# EAGLE design LaserConverterBoard (EAGLE 7.1.0)
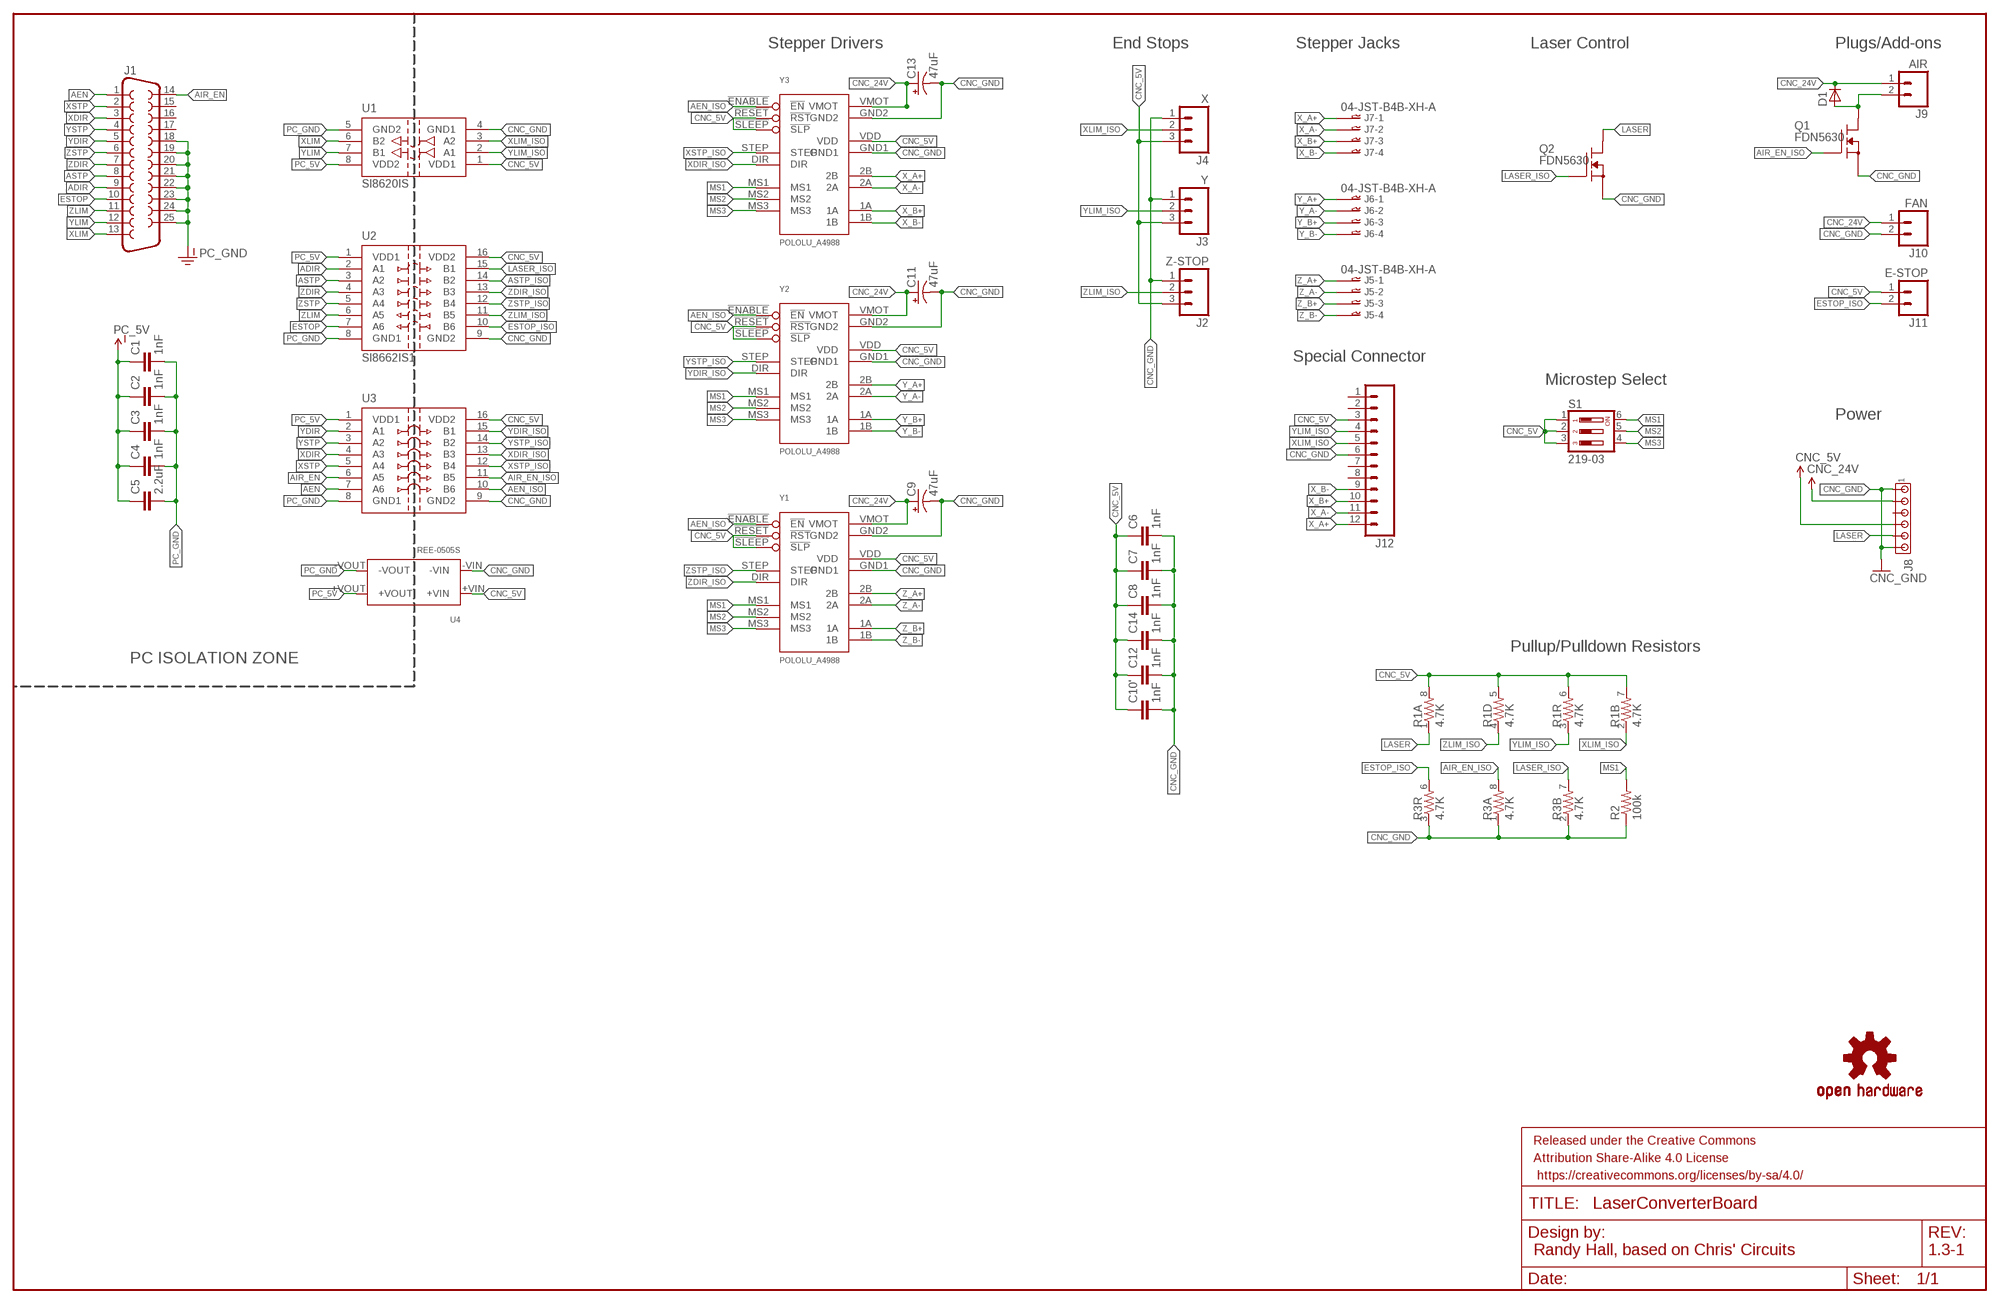
[diagram p0: schematic, sheet 1]

## Parts
C1  1nF  1NF/1000PF-50V-10%(0603)  [0603-CAP]
C2  1nF  1NF/1000PF-50V-10%(0603)  [0603-CAP]
C3  1nF  1NF/1000PF-50V-10%(0603)  [0603-CAP]
C4  1nF  1NF/1000PF-50V-10%(0603)  [0603-CAP]
C5  2.2uF  1NF/1000PF-50V-10%(0603)  [0603-CAP]
C6  1nF  1NF/1000PF-50V-10%(0603)  [0603-CAP]
C7  1nF  1NF/1000PF-50V-10%(0603)  [0603-CAP]
C8  1nF  1NF/1000PF-50V-10%(0603)  [0603-CAP]
C9  47uF  CPOL-USE  [PANASONIC_E]
C10'  1nF  1NF/1000PF-50V-10%(0603)  [0603-CAP]
C11  47uF  CPOL-USE  [PANASONIC_E]
C12  1nF  1NF/1000PF-50V-10%(0603)  [0603-CAP]
C13  47uF  CPOL-USE  [PANASONIC_E]
C14  1nF  1NF/1000PF-50V-10%(0603)  [0603-CAP]
D1  D-SOD123  [SOD123]
FRAME1  FRAME-LEDGER  [CREATIVE_COMMONS]
J1  F25HP  [F25HP]
J2  Z-STOP  M03PTH  [1X03]
J3  Y  M03PTH  [1X03]
J4  X  M03PTH  [1X03]
J5  04-JST-B4B-XH-A  [B4B-XH]
J6  04-JST-B4B-XH-A  [B4B-XH]
J7  04-JST-B4B-XH-A  [B4B-XH]
J8  MTA06-156  [1X6MTA]
J9  AIR  M02PTH  [1X02]
J10  FAN  M02PTH  [1X02]
J11  E-STOP  M02PTH  [1X02]
J12  M12  [12P]
LOGO1  OSHW-LOGOS  [OSHW-LOGO-S]
Q1  FDN5630  [SOT23]
Q2  FDN5630  [SOT23]
R1  4.7K  RESISTOR-ARRAY0603-ARV  [0603-ARV]
R2  100k  100KOHM1/10W1%(0603)  [0603-RES]
R3  4.7K  RESISTOR-ARRAY0603-ARV  [0603-ARV]
S1  219-03  [CTS-219-03]
U1  SI8620IS  [SO08]
U2  SI8662IS1  SI8462IS1  [SO16]
U3  SI8460IS1  [SO16]
U4  REE-0505S  [SIP7]
Y1  POLOLU_A4988  [POLOLU_STEPPER_DRIVER]
Y2  POLOLU_A4988  [POLOLU_STEPPER_DRIVER]
Y3  POLOLU_A4988  [POLOLU_STEPPER_DRIVER]

## Nets
ADIR: J1.9 U2.2(A1)
AEN: J1.1 U3.7(A6)
AEN_ISO: U3.10(B6) Y1.!ENABLE(!EN) Y2.!ENABLE(!EN) Y3.!ENABLE(!EN)
AIR_EN: J1.14 U3.6(A5)
AIR_EN_ISO: Q1.1(G) R3.8 U3.11(B5)
ASTP: J1.8 U2.3(A2)
ASTP_ISO: U2.14(B2)
CNC_5V: C6.1 C7.1 C8.1 C10'.1 C12.1 C14.1 J2.3 J3.3 J4.3 J8.4 J11.1 J12.3 R1.5 R1.6 R1.7 R1.8 S1.1 S1.2 S1.3 U1.1(VDD1) U2.16(VDD2) U3.16(VDD2) U4.+VIN Y1.!RESET(!RST) Y1.!SLEEP(!SLP) Y1.VDD Y2.!RESET(!RST) Y2.!SLEEP(!SLP) Y2.VDD Y3.!RESET(!RST) Y3.!SLEEP(!SLP) Y3.VDD
CNC_24V: C9.+ C11.+ C13.+ D1.1(C) J8.2 J9.1 J10.1 Y1.VMOT Y2.VMOT Y3.VMOT
CNC_GND: C6.2 C7.2 C8.2 C9.- C10'.2 C11.- C12.2 C13.- C14.2 J2.1 J3.1 J4.1 J8.1 J8.6 J10.2 J12.6 Q1.2(S) Q2.2(S) R2.1 R3.1 R3.2 R3.3 U1.4(GND1) U2.9(GND2) U3.9(GND2) U4.-VIN Y1.GND1 Y1.GND2 Y2.GND1 Y2.GND2 Y3.GND1 Y3.GND2
ESTOP: J1.10 U2.7(A6)
ESTOP_ISO: J11.2 R3.6 U2.10(B6)
LASER: J8.5 Q2.3(D) R1.1
LASER_ISO: Q2.1(G) R3.7 U2.15(B1)
MS1: R2.2 S1.6 Y1.MS1 Y2.MS1 Y3.MS1
MS2: S1.5 Y1.MS2 Y2.MS2 Y3.MS2
MS3: S1.4 Y1.MS3 Y2.MS3 Y3.MS3
N$8: D1.2(A) J9.2 Q1.3(D)
PC_5V: C1.1 C2.1 C3.1 C4.1 C5.1 U1.8(VDD2) U2.1(VDD1) U3.1(VDD1) U4.+VOUT
PC_GND: C1.2 C2.2 C3.2 C4.2 C5.2 J1.18 J1.19 J1.20 J1.21 J1.22 J1.23 J1.24 J1.25 U1.5(GND2) U2.8(GND1) U3.8(GND1) U4.-VOUT
X_A+: J7.P$1 J12.12 Y3.2B
X_A-: J7.P$2 J12.11 Y3.2A
X_B+: J7.P$3 J12.10 Y3.1A
X_B-: J7.P$4 J12.9 Y3.1B
XDIR: J1.3 U3.4(A3)
XDIR_ISO: U3.13(B3) Y3.DIR
XLIM: J1.13 U1.6(B2)
XLIM_ISO: J4.2 J12.5 R1.2 U1.3(A2)
XSTP: J1.2 U3.5(A4)
XSTP_ISO: U3.12(B4) Y3.STEP
Y_A+: J6.P$1 Y2.2B
Y_A-: J6.P$2 Y2.2A
Y_B+: J6.P$3 Y2.1A
Y_B-: J6.P$4 Y2.1B
YDIR: J1.5 U3.2(A1)
YDIR_ISO: U3.15(B1) Y2.DIR
YLIM: J1.12 U1.7(B1)
YLIM_ISO: J3.2 J12.4 R1.3 U1.2(A1)
YSTP: J1.4 U3.3(A2)
YSTP_ISO: U3.14(B2) Y2.STEP
Z_A+: J5.P$1 Y1.2B
Z_A-: J5.P$2 Y1.2A
Z_B+: J5.P$3 Y1.1A
Z_B-: J5.P$4 Y1.1B
ZDIR: J1.7 U2.4(A3)
ZDIR_ISO: U2.13(B3) Y1.DIR
ZLIM: J1.11 U2.6(A5)
ZLIM_ISO: J2.2 R1.4 U2.11(B5)
ZSTP: J1.6 U2.5(A4)
ZSTP_ISO: U2.12(B4) Y1.STEP
Unconnected: J1.15 J1.16 J1.17 J8.3 J12.1 J12.2 J12.7 J12.8 R3.4 R3.5

## Notes on the sheet
- Stepper Drivers | End Stops | Stepper Jacks | Laser Control | Plugs/Add-ons
- Special Connector
- Microstep Select
- Power
- Pullup/Pulldown Resistors
- PC ISOLATION ZONE
- Randy Hall, based on Chris' Circuits | 1.3-1

## Library data of the parts
C1-C4 C6-C8 C10' C12 C14 = SparkFun-Capacitors:1NF/1000PF-50V-10%(0603): CAP-07886; PROD_ID: CAP-07886
C5 = SparkFun-Capacitors:1NF/1000PF-50V-10%(0603): CAP-07886; PROD_ID: CAP-07886; VALUE: 1nF
C9 C11 C13 = rcl:CPOL-US: POLARIZED CAPACITOR, American symbol
D1 = semicon-smd-ipc:D-: DIODE unfilled
FRAME1 = SparkFun-Aesthetics:FRAME-LEDGER: Schematic Frame Standard 11x14 US Ledger frame
J1 = SparkFun-Connectors:F25: 25 Pin male connector. PCB edge mount for regular PCB thicknesses. This connector will connect directly to the back of a PC parallel port or through a normal DB25 extension cable (M/F). SKU: PRT-08287
J2-J4 = SparkFun-Connectors:M03: Header 3 Standard 3-pin 0.1" header. Use with straight break away headers (SKU : PRT-00116), right angle break away headers (PRT-00553), swiss pins (PRT-00743), machine pins (PRT-00117), and female headers (PRT-00115). Molex polarized connector foot print use with SKU : PRT-08232 with associated crimp pins and housings.
J5-J7 = con-jst-xh:04-JST: JST CONNECTOR
J8 = con-amp:MTA06-156: AMP connector
J9-J11 = SparkFun-Connectors:M02: Standard 2-pin 0.1" header. Use with - straight break away headers ( PRT-00116) - right angle break away headers (PRT-00553) - swiss pins (PRT-00743) - machine pins (PRT-00117) - female headers (PRT-00115) Molex polarized connector foot print use with: PRT-08233 with associated crimp pins and housings. 2.54_SCREWTERM for use with PRT-10571. 3.5mm Screw Terminal footprints for PRT-08084 5mm Screw Terminal footprints for use with PRT-08433
J12 = con-amp-te:M12: TE CONNECTIVITY FFC/FPC CONNECTOR 12P Used for FFC/FPC connections.; OC_FARNELL: unknown; OC_NEWARK: unknown
LOGO1 = SparkFun-Aesthetics:OSHW-LOGO: Open Source Hardware Logo This logo indicates the piece of hardware it is found on incorporates a OSHW license and/or adheres to the definition of open source hardware found here: http://freedomdefined.org/OSHW
Q1 Q2 = Fairchild_By_element14_Batch_1:FDN5630
R1 R3 = SparkFun-Resistors:RESISTOR-ARRAY: Array Chip Resistor Source: RS Component / Phycomp
R2 = SparkFun-Resistors:100KOHM1/10W1%(0603): RES-07828; PROD_ID: RES-07828
S1 = switch-dil:219-03*: Surface Mount DIP Switch Series 219 SMT CTS Electronic Components Sourc: www.ctscorp.com; OC_FARNELL: unknown; OC_NEWARK: unknown
U1 = silicon-labs:SI8620: Si8420 2 Channel (2/0) Digital Isolator Silicon Labs Si84xx ISOpro digital isolator series. The Si84xx ISOpro digital isolators provide low power galvanic isolation for digital signals. The '20 part has both signals in the same direction, with no output enables. It is available in SOIC-8 and wide SOIC-16 packages. They come in speeds of 1Mbps and 150Mbps, and isolation ratings of 1KV, 2.5KV and 5KV. The independent sides use 2.7-5.5V supplies and draw under 5mA per channel. http://www.silabs.com/Support%20Documents/TechnicalDocs/Si822x.pdf Donald Becker
U2 = silicon-labs:SI8462: Si8462 6 Channel (4/2) Digital Isolator Silicon Labs Si84xx ISOpro digital isolator series. The Si84xx ISOpro digital isolators provide low power galvanic isolation for digital signals. They come in speeds of 1Mbps and 150Mbps, and isolation ratings of 1KV, 2.5KV and 5KV. The independent sides use 2.7-5.5V supplies and draw under 5mA per channel. Donald Becker
U3 = silicon-labs:SI8460: Si8460 6 Channel (6/0) Digital Isolator Silicon Labs Si84xx ISOpro digital isolator series. The Si84xx ISOpro digital isolators provide low power galvanic isolation for digital signals. They come in speeds of 1Mbps and 150Mbps, and isolation ratings of 1KV, 2.5KV and 5KV. The independent sides use 2.7-5.5V supplies and draw under 5mA per channel. Donald Becker
U4 = recom-international:REE-0505S
Y1-Y3 = pololu:POLOLU_A4988

## Board
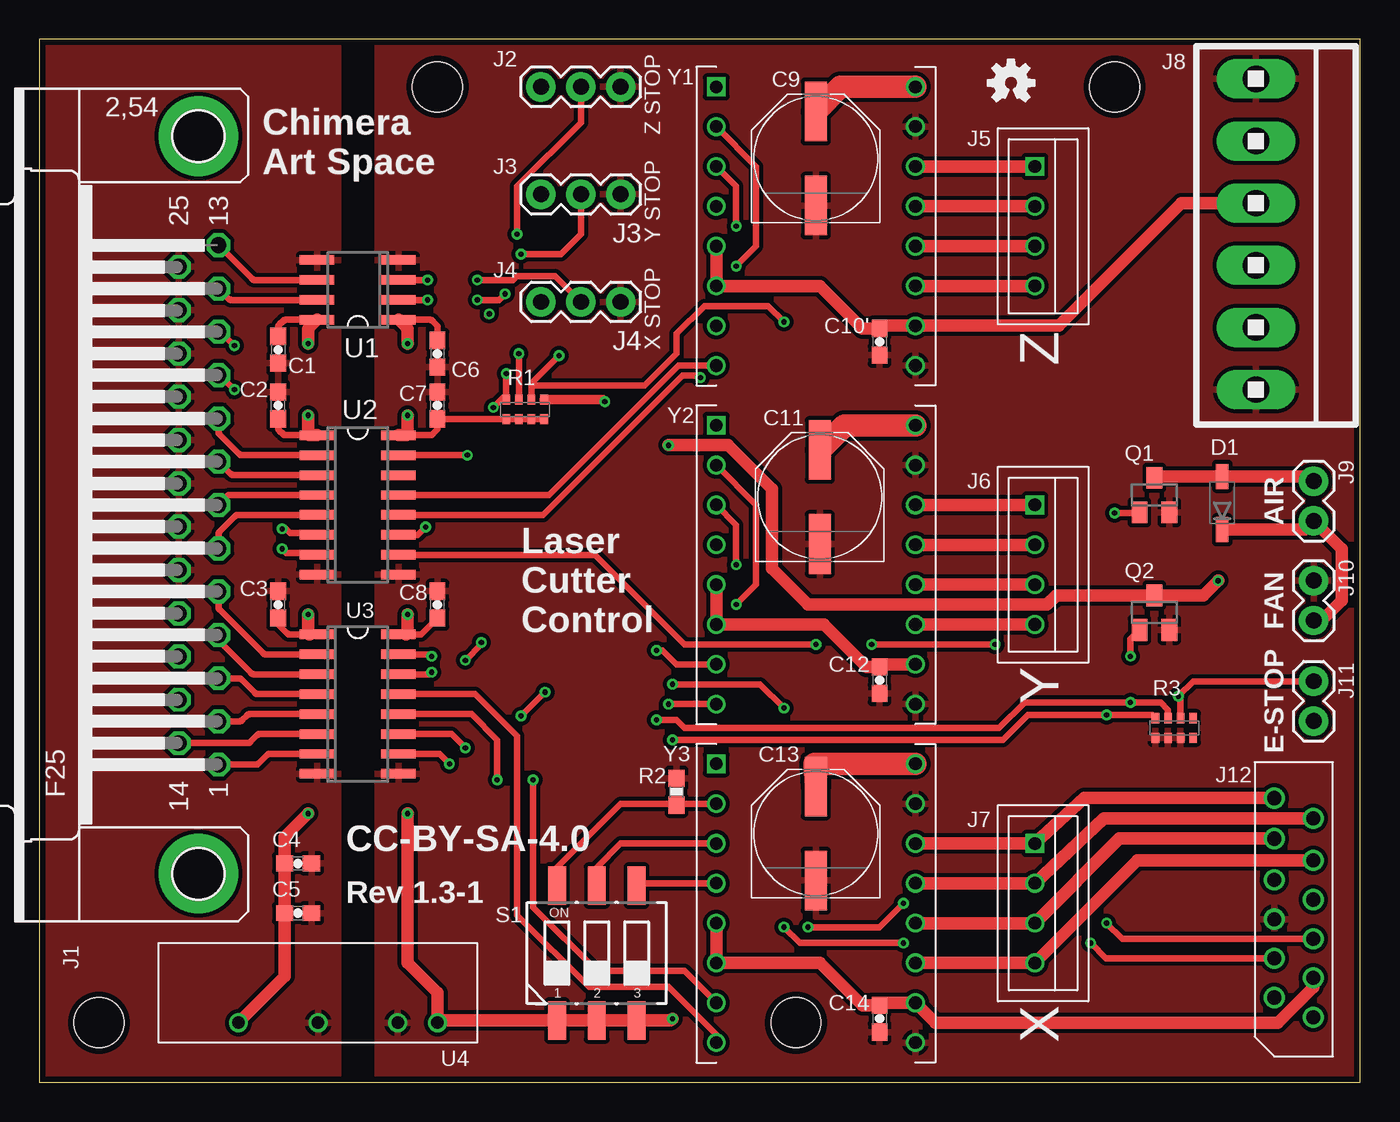
[diagram p1: board, top side]
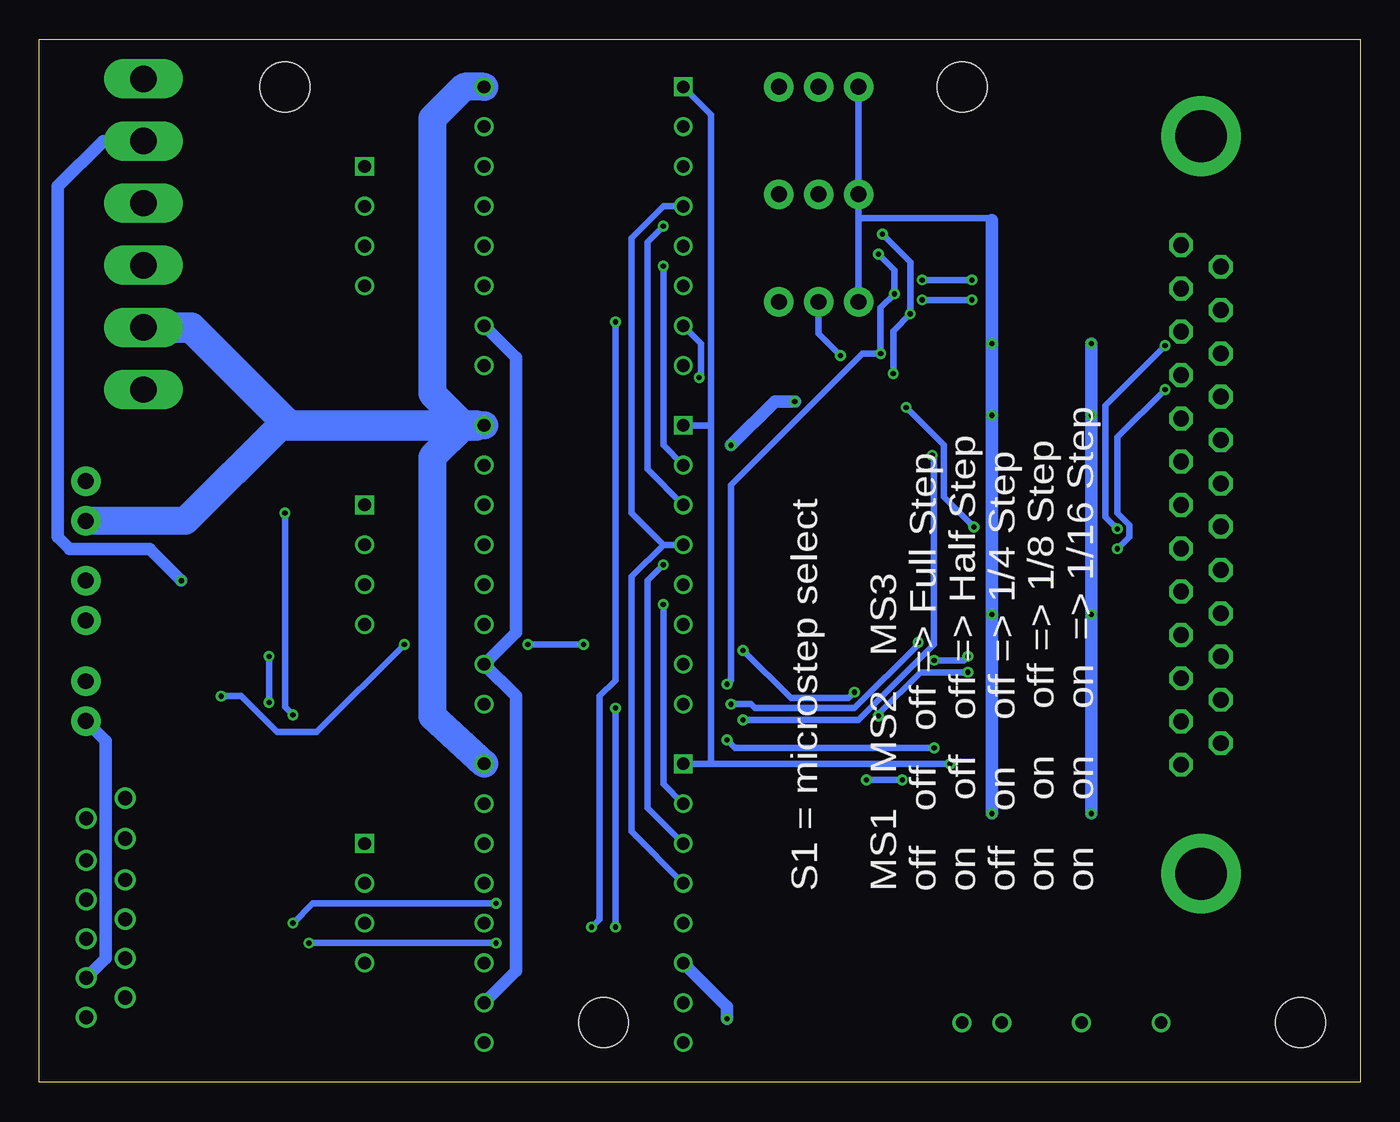
[diagram p2: board, bottom side, seen from below]

Size 84.25 x 66.54 mm. Coordinates in mm from the lower left corner, seen from the top.
Outline: 0,0 84.25,0 84.25,66.54 0,66.54 0,0
Copper layers (1*16): Top 0.0356mm / dielectric 1.5011mm / Bottom 0.0356mm
Design rules "OSHPark *": minimum track width 6mil, minimum drill 13mil, track to track 6mil, track to pad 6mil, pad to pad 6mil, via to via 6mil, smd to smd 6mil, copper to edge 15mil, drill to drill 6mil, minimum pad ring 7mil, minimum via ring 7mil, stop-mask expansion 3mil, vias tented up to drill 25mil, thermal gap 10mil
Holes 3.17 mm at 25.4,63.5 3.81,3.81 48.26,3.81 68.58,63.5

### Footprints (pad centres in the part's own frame; a part is rotated, then mirrored left to right if it is on the bottom)
0603-CAP = smd 1.1 x 1: 1 -0.85,0; 2 0.85,0
PANASONIC_E = smd 3.8 x 1.4: + 3,0; - -3,0
SOD123 = smd 1.6 x 0.8: 1 -1.7,0; 2 1.7,0
F25HP = drill 1.016 octagon: 1 -16.561,-1.27; 2 -13.792,-1.27; 3 -11.049,-1.27; 4 -8.28,-1.27; 5 -5.512,-1.27; 6 -2.769,-1.27; 7 0,-1.27; 8 2.769,-1.27; 9 5.512,-1.27; 10 8.28,-1.27; 11 11.049,-1.27; 12 13.792,-1.27; 13 16.561,-1.27; 14 -15.189,1.27; 15 -12.421,1.27; 16 -9.652,1.27; 17 -6.909,1.27; 18 -4.14,1.27; 19 -1.372,1.27; 20 1.372,1.27; 21 4.14,1.27; 22 6.909,1.27; 23 9.652,1.27; 24 12.421,1.27; 25 15.189,1.27 | drill 3.302 pad 5.08: G1 -23.52,0; G2 23.52,0
1X03 = drill 1.016 pad 1.88: 1 0,0; 2 2.54,0; 3 5.08,0
B4B-XH = drill 0.8 square: P$1 -3.81,0 | drill 0.8: P$2 -1.27,0; P$3 1.27,0; P$4 3.81,0
1X6MTA = drill 1.676 long: 1 9.906,0; 2 5.944,0; 3 1.981,0; 4 -1.981,0; 5 -5.944,0; 6 -9.906,0
1X02 = drill 1.016 pad 1.88: 1 0,0; 2 2.54,0
12P = drill 0.9: 1 -6.25,-1.25; 2 -5,1.25; 3 -3.75,-1.25; 4 -2.5,1.25; 5 -1.25,-1.25; 6 0,1.25; 7 1.25,-1.25; 8 2.5,1.25; 9 3.75,-1.25; 10 5.14,1.25; 11 6.43,-1.25; 12 7.72,1.25
SOT23 = smd 1 x 1.4: 1 -0.95,-1.1; 2 0.95,-1.1; 3 0,1.1
0603-ARV = smd 0.5 x 0.65: 1 -1.2,-0.625; 2 -0.4,-0.625; 3 0.4,-0.625; 4 1.2,-0.625; 5 1.2,0.625; 6 0.4,0.625; 7 -0.4,0.625; 8 -1.2,0.625
0603-RES = smd 1.1 x 1: 1 -0.85,0; 2 0.85,0
CTS-219-03 = smd 1.13 x 2.44: 1 -2.54,-4.3; 2 0,-4.3; 3 2.54,-4.3; 4 2.54,4.3; 5 0,4.3; 6 -2.54,4.3
SO08 = smd 0.6 x 2.2: 1 -1.905,-2.6; 2 -0.635,-2.6; 3 0.635,-2.6; 4 1.905,-2.6; 5 1.905,2.6; 6 0.635,2.6; 7 -0.635,2.6; 8 -1.905,2.6
SO16 = smd 0.6 x 2.2: 1 -4.445,-2.6; 2 -3.175,-2.6; 3 -1.905,-2.6; 4 -0.635,-2.6; 5 0.635,-2.6; 6 1.905,-2.6; 7 3.175,-2.6; 8 4.445,-2.6; 9 4.445,2.6; 10 3.175,2.6; 11 1.905,2.6; 12 0.635,2.6; 13 -0.635,2.6; 14 -1.905,2.6; 15 -3.175,2.6; 16 -4.445,2.6
SIP7 = drill 0.8: +VIN 2.54,5.08; +VOUT 15.24,5.08; -VIN 5.08,5.08; -VOUT 10.16,5.08
POLOLU_STEPPER_DRIVER = drill 0.8: 1A 6.35,-1.27; 1B 6.35,-3.81; 2A 6.35,1.27; 2B 6.35,3.81; !RESET -6.35,-1.27; !SLEEP -6.35,-3.81; DIR -6.35,-8.89; GND1 6.35,-8.89; GND2 6.35,6.35; MS1 -6.35,6.35; MS2 -6.35,3.81; MS3 -6.35,1.27; STEP -6.35,-6.35; VDD 6.35,-6.35; VMOT 6.35,8.89 | drill 0.8 square: !ENABLE -6.35,8.89

### Placement (x,y rotation side)
C1  15.24,46.74 270 top
C2  15.24,43.18 90 top
C3  15.24,30.48 90 top
C4  16.51,13.97 0 top
C5  16.51,10.79 0 top
C6  25.4,46.48 270 top
C7  25.4,43.18 90 top
C8  25.4,30.48 90 top
C9  49.53,58.93 90 top
C10'  53.59,47.24 270 top
C11  49.78,37.34 90 top
C12  53.59,25.65 270 top
C13  49.53,15.88 90 top
C14  53.59,4.06 270 top
D1  75.44,36.96 90 top
FRAME1  24.13,-10.16 0 top  (outside the outline)
J1  10.16,36.83 90 top
J2  37.08,63.5 180 top
J3  37.08,56.64 180 top
J4  37.08,49.78 180 top
J5  63.5,54.61 270 top
J6  63.5,33.02 270 top
J7  63.5,11.43 270 top
J8  77.6,54.1 270 top
J9  81.28,35.81 90 top
J10  81.28,29.46 90 top
J11  81.28,23.05 90 top
J12  80.01,10.41 90 top
LOGO1  61.98,63.75 0 top
Q1  71.12,37.47 0 top
Q2  71.12,29.97 0 top
R1  30.99,42.93 180 top
R2  40.64,18.54 270 top
R3  72.39,22.61 0 top
S1  35.56,8.26 0 top
U1  20.32,50.55 90 top
U2  20.32,36.83 270 top
U3  20.32,24.13 270 top
U4  27.94,8.89 180 top
Y1  49.53,54.61 0 top
Y2  49.53,33.02 0 top
Y3  49.53,11.43 0 top

### Tracks (layer width: path | path; a pad name or v marks a point on that pad's centre or on a via)
ADIR
  Top 0.406: J1.9 11.43,41.51 arc45 11.5,41.33 12.75,40.08 arc45 12.93,40.01 U2.2
AEN
  Top 0.406: J1.1 13.81,20.27 arc45 13.99,20.34 14.53,20.88 arc-45 14.71,20.95 U3.7
AEN_ISO  (via drill 0.33)
  Top 0.406: U3.10 25.53,20.95 v26.16,20.32
  Bottom 0.406: v26.16,20.32 41.4,20.32 | 41.4,20.32 Y3.!ENABLE | Y2.!ENABLE 41.4,41.91 | 41.4,41.91 41.4,20.32 | Y1.!ENABLE 41.4,61.72 41.4,41.91
AIR_EN
  Top 0.406: J1.14 13.28,21.64 arc45 13.46,21.71 13.9,22.15 arc-45 14.07,22.23 U3.6
AIR_EN_ISO  (via drill 0.33)
  Top 0.406: U3.11 26.29,22.23 v27.18,21.34 | v40.39,21.84 61.47,21.84 63.06,23.44 v68.07,23.44 70.98,23.44 R3.8 | v68.58,36.32 70.13,36.32 Q1.1
  Bottom 0.406: v27.18,21.34 39.88,21.34 v40.39,21.84 | v68.58,36.32 68.58,23.95 v68.07,23.44
ASTP
  Top 0.406: J1.8 12.22,38.81 arc45 12.4,38.73 U2.3
CNC_5V  (via drill 0.33)
  Top 0.406: C8.1 24.34,28.57 23.39,28.57 | R1.8 R1.7 R1.6 R1.5 25.43,42.3 C7.1 25.4,41.76 arc-45 25.33,41.58 25.09,41.35 arc-45 24.91,41.27 U2.16 | C6.1 25.4,48.16 arc45 25.33,48.33 25.09,48.57 arc45 24.91,48.64 U1.1 | U3.16 23.11,28.57 23.5,28.68
  Top 0.813: v23.5,17.14 23.5,7.62 25.4,5.71 U4.+VIN 25.55,3.96 S1.1 S1.2 S1.3 40.28,3.96 v40.39,4.06 | v23.5,29.84 23.5,28.68 23.39,28.57 | Y3.!RESET Y3.!SLEEP 49.78,7.62 52.49,4.91 C14.1 54.01,5.08 Y3.VDD 57.15,3.81 78.99,3.81 81.26,6.08 J12.3 | Y2.!RESET Y2.!SLEEP 50.04,29.21 52.74,26.5 C12.1 53.76,26.67 Y2.VDD | J8.4 72.85,56.08 65.02,48.26 Y1.VDD 53.76,48.26 C10'.1 52.49,48.09 49.78,50.8 Y1.!SLEEP Y1.!RESET | v23.5,42.55 23.5,41.48 arc-45 23.42,41.3 U2.16 | U1.1 23.42,48.14 arc-45 23.5,47.96 v23.5,47.12
  Bottom 0.406: 32,55.12 23.73,55.12 arc45 23.55,55.04 23.5,54.99 | 32,55.12 J3.3 J2.3 | J4.3 32,55.12
  Bottom 0.813: v23.5,17.14 v23.5,29.84 v23.5,42.55 v23.5,47.12 23.5,54.99 | v40.39,4.06 40.39,4.83 Y3.!SLEEP | Y3.VDD 53.85,7.11 53.85,24.64 Y2.VDD 53.85,28.7 53.85,46.23 Y1.VDD | J12.3 80.01,7.91 80.01,21.78 J11.1
CNC_24V
  Top 0.813: D1.1 80.72,35.26 J9.1 83.06,34.04 83.06,30.73 81.79,29.46 J10.1
  Top 1.422: C13.+ 49.45,20.32 Y3.VMOT | C9.+ 51.1,63.5 Y1.VMOT | C11.+ 51.36,41.91 Y2.VMOT
  Bottom 1.778: Y3.VMOT 59.18,23.37 59.18,39.88 57.15,41.91 | Y2.VMOT 56.39,41.91 57.15,41.91 | Y1.VMOT 57.15,63.5 59.18,61.47 59.18,43.94 57.15,41.91 | 68.33,41.91 68.83,41.91 74.93,35.81 J9.1
  Bottom 1.93: J8.2 74.57,48.16 68.33,41.91 56.39,41.91
CNC_GND
  pour Top (isolate 0.254): 21.59,0.32 21.59,66.23 83.95,66.67 83.95,0.51
ESTOP  (via drill 0.33)
  Top 0.406: v12.45,44.2 11.6,45.04 arc45 J1.10 | v15.49,34.04 15.75,33.78 17.02,33.78 U2.7
  Bottom 0.406: v12.45,44.2 15.49,41.15 15.49,36.32 14.73,35.56 14.73,34.8 v15.49,34.04
ESTOP_ISO  (via drill 0.33)
  Top 0.406: v49.53,27.94 41.15,27.94 35.43,33.66 U2.10 | v53.09,27.94 v60.96,27.94 | R3.6 72.79,24.49 v72.64,24.64 73.6,25.59 J11.2
  Bottom 0.406: v49.53,27.94 v53.09,27.94 | v60.96,27.94 66.55,22.35 69.09,22.35 71.37,24.64 v72.64,24.64
LASER  (via drill 0.33)
  Top 0.61: v36.07,43.43 35.95,43.55 R1.1
  Top 0.813: v75.18,32 74.25,31.07 Q2.3 64.85,31.07 64.26,30.48 49.02,30.48 46.74,32.77 46.74,37.85 43.94,40.64 v40.13,40.64
  Bottom 0.813: J8.5 80.16,60.05 83.06,57.15 83.06,34.8 82.3,34.04 77.22,34.04 v75.18,32 | v40.13,40.64 37.34,43.43 v36.07,43.43
LASER_ISO  (via drill 0.33)
  Top 0.406: v39.37,23.11 40.64,23.11 41.15,22.61 61.21,22.61 62.85,24.24 v69.6,24.24 71.52,24.24 71.99,23.77 R3.7 | Q2.1 69.6,28.3 v69.6,27.18 | v27.3,40.01 U2.15
  Bottom 0.406: v39.37,23.11 32,23.11 27.18,27.94 27.18,40.01 v27.3,40.01 | v69.6,27.18 v69.6,24.24
MS1  (via drill 0.33)
  Top 0.406: S1.6 33.02,13.72 37.08,17.78 40.55,17.78 R2.2 40.73,17.78 Y3.MS1 | v44.45,52.07 45.72,53.34 45.72,58.42 Y1.MS1 | v44.45,30.48 45.72,31.75 45.72,36.83 Y2.MS1
  Bottom 0.406: Y2.MS1 44.45,40.64 v44.45,52.07 | v44.45,30.48 44.45,19.05 Y3.MS1
MS2  (via drill 0.33)
  Top 0.406: S1.5 35.56,13.72 37.08,15.24 Y3.MS2 | v44.45,54.61 44.45,57.15 Y1.MS2 | v44.45,33.02 44.45,35.56 Y2.MS2
  Bottom 0.406: Y2.MS2 45.47,39.12 45.47,53.59 v44.45,54.61 | v44.45,33.02 45.47,32 45.47,17.53 Y3.MS2
MS3
  Top 0.406: S1.4 38.24,12.7 Y3.MS3
  Bottom 0.406: Y2.MS3 44.45,34.29 | Y1.MS3 44.45,55.88 46.48,53.85 46.48,36.32 44.45,34.29 | 44.45,34.29 46.48,32.26 46.48,16 Y3.MS3
N$8
  Top 0.813: J9.2 80.98,38.66 D1.2 71.21,38.66 Q1.3
PC_5V  (via drill 0.33)
  Top 0.406: C3.1 15.24,29.32 arc45 15.31,29.14 15.8,28.65 arc45 15.98,28.57 17.25,28.57 | C2.1 15.24,41.76 arc45 15.31,41.58 15.55,41.35 arc45 15.73,41.27 U2.1 | C1.1 15.24,48.16 arc-45 15.31,48.33 15.55,48.57 arc-45 15.73,48.64 U1.8 | U3.1 17.53,28.57 17.14,28.68
  Top 0.813: U4.+VOUT 15.66,6.77 C5.1 C4.1 15.66,15.66 v17.14,17.14 | v17.14,29.84 17.14,28.68 arc90 17.25,28.57 | v17.14,42.55 17.14,41.48 arc45 17.22,41.3 U2.1 | U1.8 17.22,48.14 arc45 17.14,47.96 v17.14,47.12
  Bottom 0.813: v17.14,17.14 v17.14,29.84 v17.14,42.55 v17.14,47.12
PC_GND
  pour Top (isolate 0.254): 0,66.17 19.05,66.17 19.05,0 0,0
X_A+
  Top 0.813: Y3.2B J7.P$1 66.65,18.13 J12.12
X_A-
  Top 0.813: Y3.2A J7.P$2 67.9,16.84 J12.11
X_B+
  Top 0.813: Y3.1A J7.P$3 68.89,15.55 J12.10
X_B-
  Top 0.813: Y3.1B J7.P$4 70.04,14.16 J12.9
XDIR
  Top 0.406: J1.3 12.72,25.78 arc-45 12.9,25.71 13.77,24.84 arc45 13.95,24.77 U3.4
XDIR_ISO
  Top 0.406: Y3.DIR 43.18,3.05 40.13,6.1 35.05,6.1 30.48,10.67 30.48,22.1 27.81,24.77 U3.13
XLIM
  Top 0.406: J1.13 13.56,51.26 arc45 13.74,51.18 U1.6
XLIM_ISO  (via drill 0.33)
  Top 0.406: J12.5 69.07,9.16 v68.07,10.16 | v55.12,11.43 53.59,9.91 v49.02,9.91 | J4.2 32.89,51.44 30.48,51.44 30.23,51.18 v27.94,51.18 | v33.15,46.35 31.39,44.6 31.39,44.45 | 31.39,44.45 R1.2 | v47.5,48.51 46.48,49.53 42.42,49.53 40.64,47.75 40.64,46.48 38.61,44.45 31.39,44.45 | v24.77,51.18 U1.3
  Bottom 0.406: v68.07,10.16 66.8,11.43 v55.12,11.43 | v49.02,9.91 48.51,10.41 48.51,24.64 47.5,25.65 v47.5,48.51 | J4.2 34.54,47.75 v33.15,46.35 | v27.94,51.18 v24.77,51.18
XSTP
  Top 0.406: J1.2 12.77,23.04 arc45 12.95,23.11 13.26,23.42 arc-45 13.44,23.5 U3.5
XSTP_ISO  (via drill 0.33)
  Top 0.406: U3.12 27.56,23.5 29.21,21.84 v29.21,19.3 | v31.5,19.3 31.5,11.18 35.56,7.11 41.15,7.11 Y3.STEP
  Bottom 0.406: v29.21,19.3 v31.5,19.3
Y_A+
  Top 0.813: Y2.2B J6.P$1
Y_A-
  Top 0.813: Y2.2A J6.P$2
Y_B+
  Top 0.813: Y2.1A J6.P$3
Y_B-
  Top 0.813: Y2.1B J6.P$4
YDIR
  Top 0.406: J1.5 11.43,30.33 arc45 11.5,30.15 14.28,27.38 arc45 14.46,27.3 U3.2
YDIR_ISO  (via drill 0.33)
  Top 0.406: v40.13,24.13 Y2.DIR | v27.18,26.92 28.19,27.94 v28.19,28.07 | v25.02,27.18 24.89,27.3 U3.15
  Bottom 0.406: v40.13,24.13 38.86,24.13 38.61,23.88 32.26,23.88 28.19,27.94 v28.19,28.07 | v27.18,26.92 25.27,26.92 v25.02,27.18
YLIM
  Top 0.406: J1.12 12.07,49.98 arc45 12.25,49.91 U1.7
YLIM_ISO  (via drill 0.33)
  Top 0.406: J12.4 68.03,7.91 v67.06,8.89 | v55.12,8.89 48.51,8.89 v47.5,9.91 | v30.73,52.83 33.27,52.83 34.54,54.1 J3.2 | v30.59,46.48 R1.3 | v47.5,23.88 45.97,25.4 v40.39,25.4 | v27.94,49.91 29.34,49.91 v29.72,50.29 | v24.77,49.91 U1.2
  Bottom 0.406: v67.06,8.89 v55.12,8.89 | v47.5,9.91 v47.5,23.88 | v30.73,52.83 29.72,51.82 v29.72,50.29 30.59,49.42 v30.59,46.48 31.75,46.48 40.13,38.1 40.13,25.65 v40.39,25.4 | v27.94,49.91 v24.77,49.91
YSTP
  Top 0.406: J1.4 11.43,28.3 arc45 11.5,28.12 13.52,26.11 arc45 13.69,26.04 U3.3
YSTP_ISO  (via drill 0.33)
  Top 0.406: Y2.STEP 40.64,26.67 39.75,27.56 v39.37,27.56 | v30.73,23.37 v32.26,24.89 | 24.89,26.04 v25.02,26.16 24.97,26.11 arc-45 24.79,26.04 U3.14
  Bottom 0.406: v39.37,27.56 36.32,24.51 32.64,24.51 v32.26,24.89 | v30.73,23.37 30.73,23.5 28.07,26.16 v25.02,26.16
Z_A+
  Top 0.813: Y1.2B J5.P$1
Z_A-
  Top 0.813: Y1.2A J5.P$2
Z_B+
  Top 0.813: Y1.1A J5.P$3
Z_B-
  Top 0.813: Y1.1B J5.P$4
ZDIR
  Top 0.406: J1.7 11.99,37.39 arc-45 12.17,37.47 U2.4
ZDIR_ISO
  Top 0.406: U2.13 32.51,37.47 40.77,45.72 Y1.DIR
ZLIM  (via drill 0.33)
  Top 0.406: v12.45,46.99 11.63,47.8 arc45 11.45,47.88 J1.11 | v15.49,35.31 15.75,35.31 16,35.05 17.02,35.05 U2.6
  Bottom 0.406: v12.45,46.99 16.26,43.18 16.26,36.07 v15.49,35.31
ZLIM_ISO  (via drill 0.33)
  Top 0.406: 28.57,48.9 v28.7,49.02 | v30.48,54.1 30.48,57.15 34.54,61.21 J2.2 | v29.79,45.21 R1.4 29.59,43.69 v28.96,43.05 | U2.11 24.13,34.92 v24.64,35.43
  Bottom 0.406: v30.48,54.1 28.7,52.32 v28.7,49.02 29.79,47.94 v29.79,45.21 | v24.64,35.43 26.54,37.34 26.54,40.64 v28.96,43.05
ZSTP
  Top 0.406: J1.6 11.43,34.95 arc-45 11.5,35.13 12.5,36.12 arc-45 12.68,36.2 U2.5
ZSTP_ISO  (via drill 0.33)
  Top 0.406: U2.12 32.13,36.2 41.02,45.09 42.04,45.09 v42.16,44.96
  Bottom 0.406: v42.16,44.96 42.04,45.09 42.04,47.12 Y1.STEP

### Text on the board
tPlace: J2 | Z STOP | J3 | Chimera / Art Space | Y STOP | J4 | X STOP | Z | Laser / Cutter / Control | Y | CC-BY-SA-4.0 | Rev 1.3-1 | X
bPlace: S1 = microstep select / / MS1 MS2 MS3 / off off off => Full Step / on off off => Half Step / off on off => 1/4 Step / on on off => 1/8 Step / on on on => 1/16 Step